# EAGLE design MICROCONTROLLER BRD (EAGLE 9.6.2)
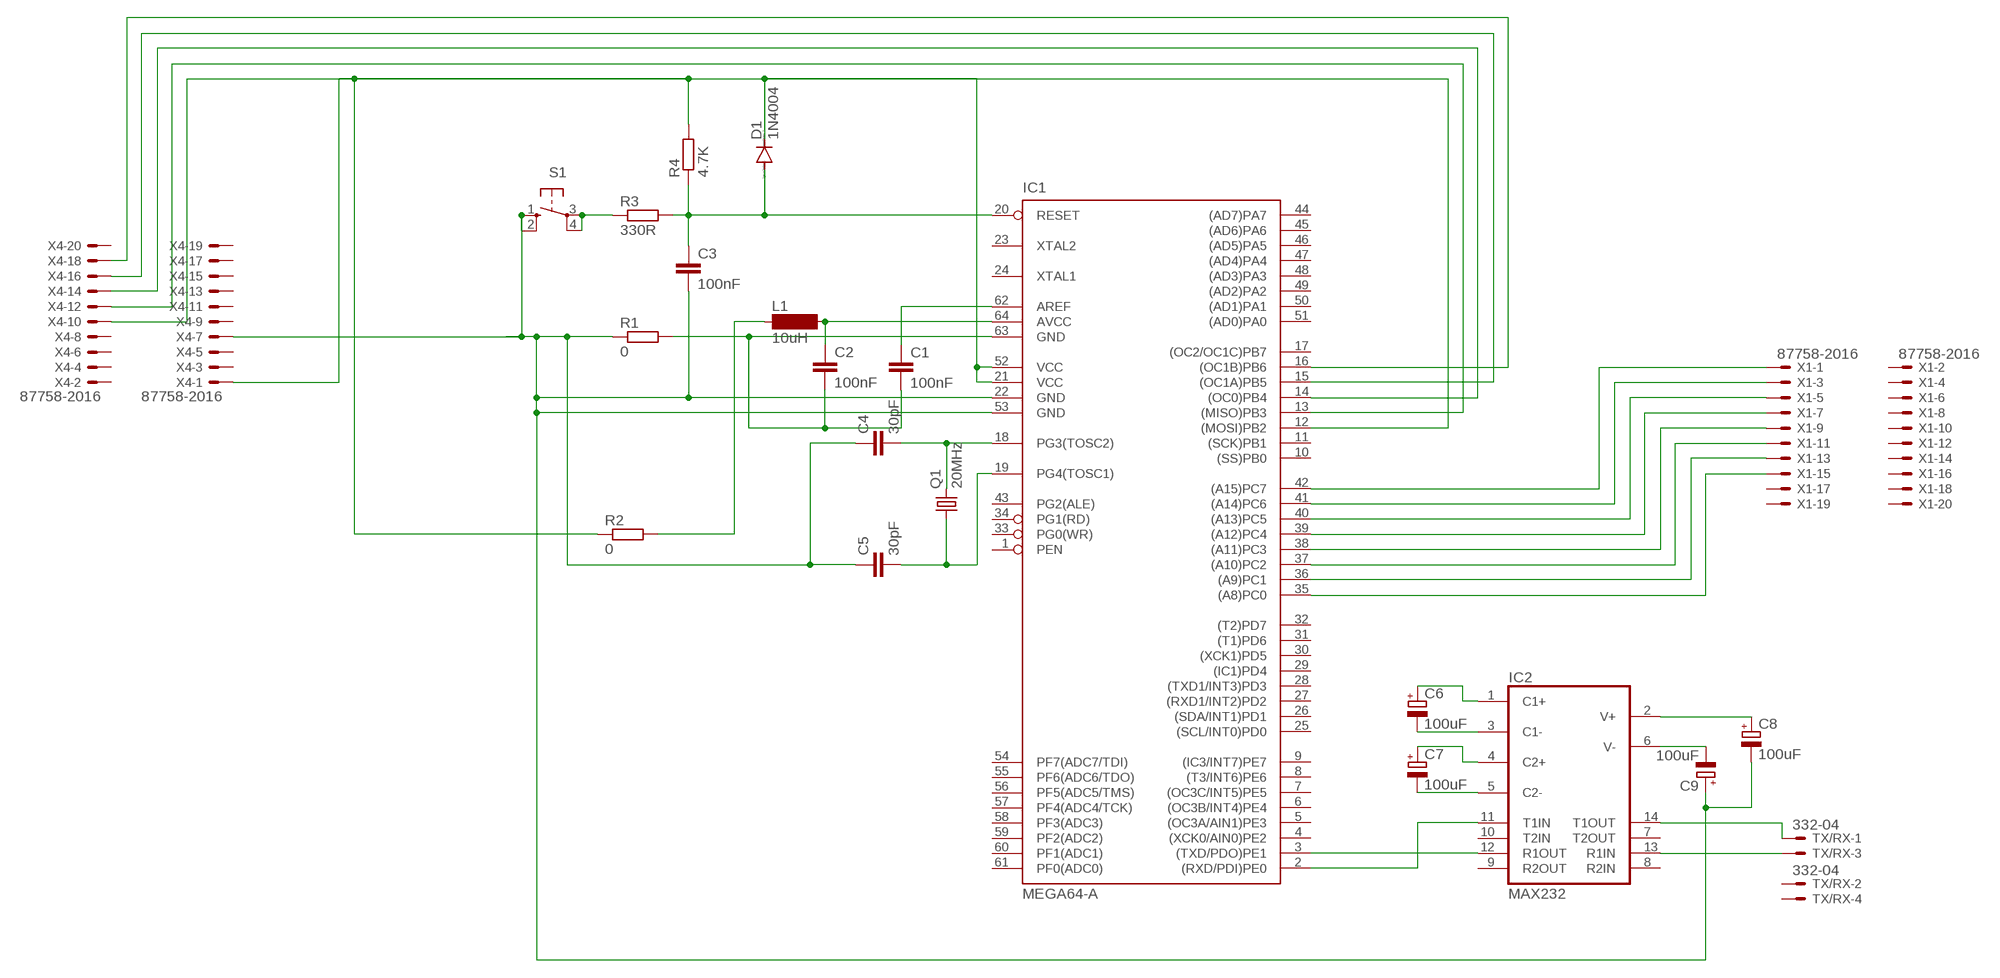
[diagram p0: schematic, sheet 1]

## Parts
C1  100nF  C-EUC0402  [C0402]
C2  100nF  C-EUC0402  [C0402]
C3  100nF  C-EUC0603  [C0603]
C4  30pF  C-EUC0603  [C0603]
C5  30pF  C-EUC0603  [C0603]
C6  100uF  CPOL-EU085CS-1AR  [085CS_1AR]
C7  100uF  CPOL-EU085CS-1AR  [085CS_1AR]
C8  100uF  CPOL-EU085CS-1AR  [085CS_1AR]
C9  100uF  CPOL-EU085CS-1AR  [085CS_1AR]
D1  1N4004  [DO41-10]
IC1  MEGA64-A  [TQFP64]
IC2  MAX232  [DIL16]
L1  10uH  SM-NE45  [SM-NE45]
Q1  20MHz  CRYSTALTC26H  [TC26H]
R1  0  R-EU_R0402  [R0402]
R2  0  R-EU_R0402  [R0402]
R3  330R  R-EU_R0603  [R0603]
R4  4.7K  R-EU_R0603  [R0603]
S1  40-XX  [B3F-40XX]
TX/RX  332-04  [332-04]
X1  87758-2016  [87758-2016]
X4  87758-2016  [87758-2016]

## Nets
N$1: R3.1 S1.3(P) S1.4(P1)
N$2: D1.C IC1.21(VCC) IC1.52(VCC) R2.1 R4.2 X4.1
N$3: C1.1 IC1.62(AREF)
N$4: C1.2 C2.2 IC1.63(GND) R1.2
N$5: C2.1 IC1.64(AVCC) L1.2
N$6: C4.2 IC1.18(PG3(TOSC2)) Q1.2
N$7: L1.1 R2.2
N$8: C3.2 C4.1 C5.1 C8.- C9.+ IC1.22(GND) IC1.53(GND) R1.1 S1.1(S) S1.2(S1) X4.7
N$9: C3.1 D1.A IC1.20(RESET) R3.2 R4.1
N$10: C5.2 IC1.19(PG4(TOSC1)) Q1.1
N$11: C6.+ IC2.1(C1+)
N$12: C6.- IC2.3(C1-)
N$13: C7.+ IC2.4(C2+)
N$14: C7.- IC2.5(C2-)
N$15: C8.+ IC2.2(V+)
N$16: C9.- IC2.6(V-)
N$17: IC1.2((RXD/PDI)PE0) IC2.11(T1IN)
N$18: IC1.3((TXD/PDO)PE1) IC2.12(R1OUT)
N$19: IC2.14(T1OUT) TX/RX.1
N$20: IC2.13(R1IN) TX/RX.3
N$21: IC1.42((A15)PC7) X1.1
N$22: IC1.41((A14)PC6) X1.3
N$23: IC1.40((A13)PC5) X1.5
N$24: IC1.39((A12)PC4) X1.7
N$25: IC1.38((A11)PC3) X1.9
N$26: IC1.37((A10)PC2) X1.11
N$27: IC1.36((A9)PC1) X1.13
N$28: IC1.35((A8)PC0) X1.15
N$30: IC1.16((OC1B)PB6) X4.18
N$31: IC1.15((OC1A)PB5) X4.16
N$32: IC1.14((OC0)PB4) X4.14
N$33: IC1.13((MISO)PB3) X4.12
N$34: IC1.12((MOSI)PB2) X4.10
Unconnected: IC1.1(PEN) IC1.4((XCK0/AIN0)PE2) IC1.5((OC3A/AIN1)PE3) IC1.6((OC3B/INT4)PE4) IC1.7((OC3C/INT5)PE5) IC1.8((T3/INT6)PE6) IC1.9((IC3/INT7)PE7) IC1.10((SS)PB0) IC1.11((SCK)PB1) IC1.17((OC2/OC1C)PB7) IC1.23(XTAL2) IC1.24(XTAL1) IC1.25((SCL/INT0)PD0) IC1.26((SDA/INT1)PD1) IC1.27((RXD1/INT2)PD2) IC1.28((TXD1/INT3)PD3) IC1.29((IC1)PD4) IC1.30((XCK1)PD5) IC1.31((T1)PD6) IC1.32((T2)PD7) IC1.33(PG0(WR)) IC1.34(PG1(RD)) IC1.43(PG2(ALE)) IC1.44((AD7)PA7) IC1.45((AD6)PA6) IC1.46((AD5)PA5) IC1.47((AD4)PA4) IC1.48((AD3)PA3) IC1.49((AD2)PA2) IC1.50((AD1)PA1) IC1.51((AD0)PA0) IC1.54(PF7(ADC7/TDI)) IC1.55(PF6(ADC6/TDO)) IC1.56(PF5(ADC5/TMS)) IC1.57(PF4(ADC4/TCK)) IC1.58(PF3(ADC3)) IC1.59(PF2(ADC2)) IC1.60(PF1(ADC1)) IC1.61(PF0(ADC0)) IC2.7(T2OUT) IC2.8(R2IN) IC2.9(R2OUT) IC2.10(T2IN) TX/RX.2 TX/RX.4 X1.2 X1.4 X1.6 X1.8 X1.10 X1.12 X1.14 X1.16 X1.17 X1.18 X1.19 X1.20 X4.2 X4.3 X4.4 X4.5 X4.6 X4.8 X4.9 X4.11 X4.13 X4.15 X4.17 X4.19 X4.20

## Power pins joined to a net without a drawn wire
GND: IC2.15(GND)
VCC: IC2.16(VCC)

## Library data of the parts
C1-C5 = rcl:C-EU: CAPACITOR, European symbol; SPICEPREFIX: C
C6-C9 = rcl:CPOL-EU: POLARIZED CAPACITOR, European symbol; SPICEPREFIX: C
D1 = diode:1N4004: DIODE general purpose rectifier, 1 A
IC1 = atmel:MEGA64: MICROCONTROLLER 64 Kbytes FLASH 4 Kbytes SRAM 2 Kbytes EEPROM DUAL USART 8-channel 10 bit ADC Source: avr.lbr; MPN: ATMEGA64-16AU; OC_FARNELL: 9171355; OC_NEWARK: 01M6899
IC2 = maxim:MAX232: RS232 TRANSCEIVER; MF: MAXIM; MPN: MAX232ACPE+; OC_FARNELL: 9723773; OC_NEWARK: 68K4544
L1 = inductor-neosid:SM-NE45: INDUCTOR SMD chip inductor; OC_FARNELL: unknown; OC_NEWARK: unknown
Q1 = crystal:CRYSTAL: CRYSTAL; OC_FARNELL: unknown; OC_NEWARK: unknown
R1-R4 = rcl:R-EU_: RESISTOR, European symbol; SPICEPREFIX: R
S1 = switch-omron:40-XX: OMRON SWITCH; MF: OMRON COMPONENTS USA; MPN: B3F-4000; OC_FARNELL: 176434; OC_NEWARK: 36K3105
TX/RX = con-garry:332-04: 4 Pin - 2mm Dual Row Source: www.mpe-connector.de / garry_shortform_2012.pdf
X1 X4 = con-molex:87758-2016: 20 Pin - 2mm Dual Row Single Wafer, Vertical T/H HDR Source: http://www.molex.com/pdm_docs/sd/877580616_sd.pdf; MF: MOLEX; MPN: 87758-2016; OC_FARNELL: 7472374; OC_NEWARK: 25M5677

## Board
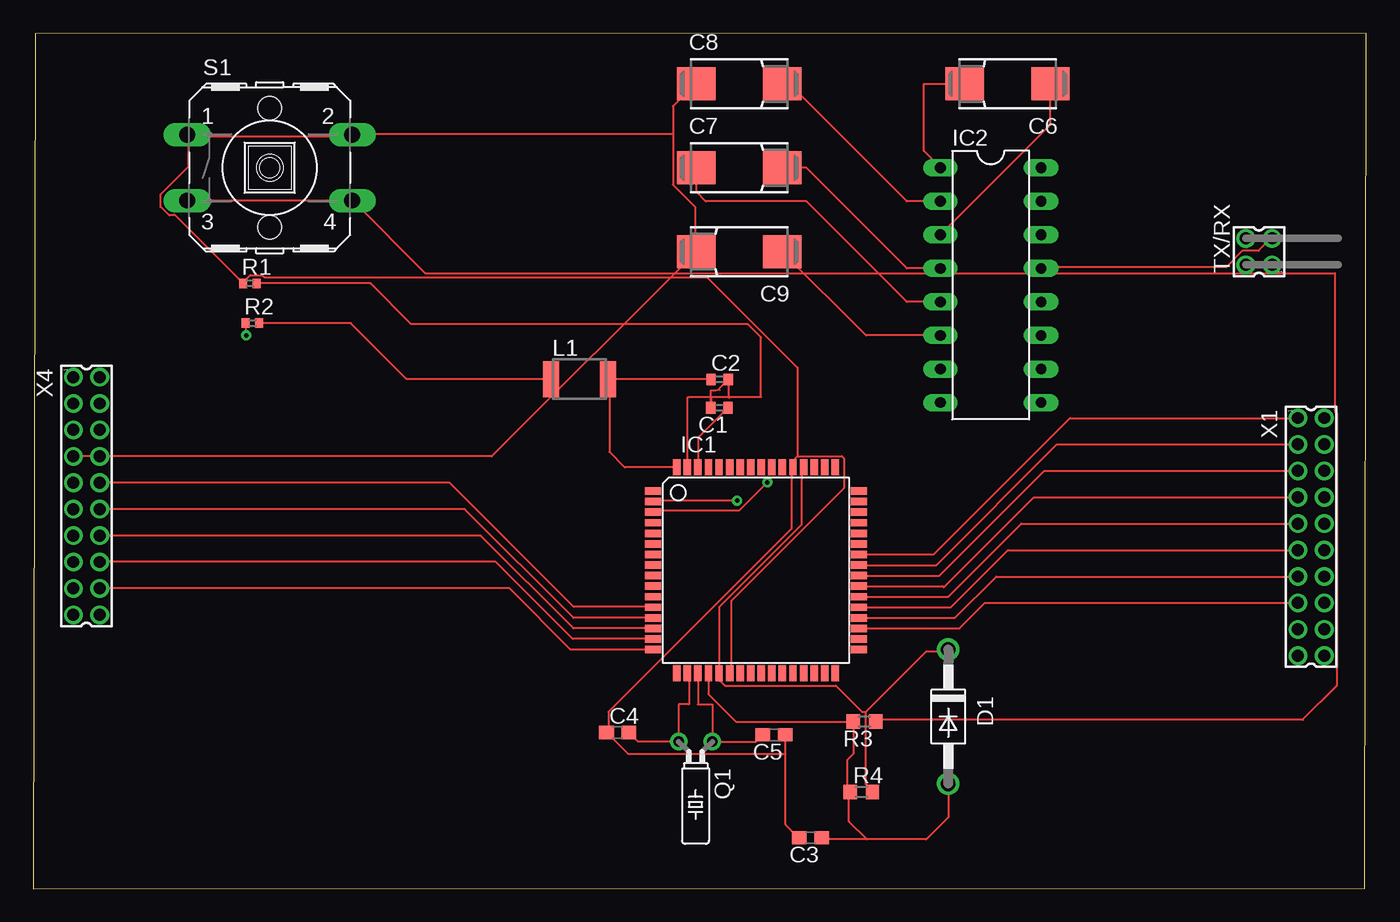
[diagram p1: board, top side]
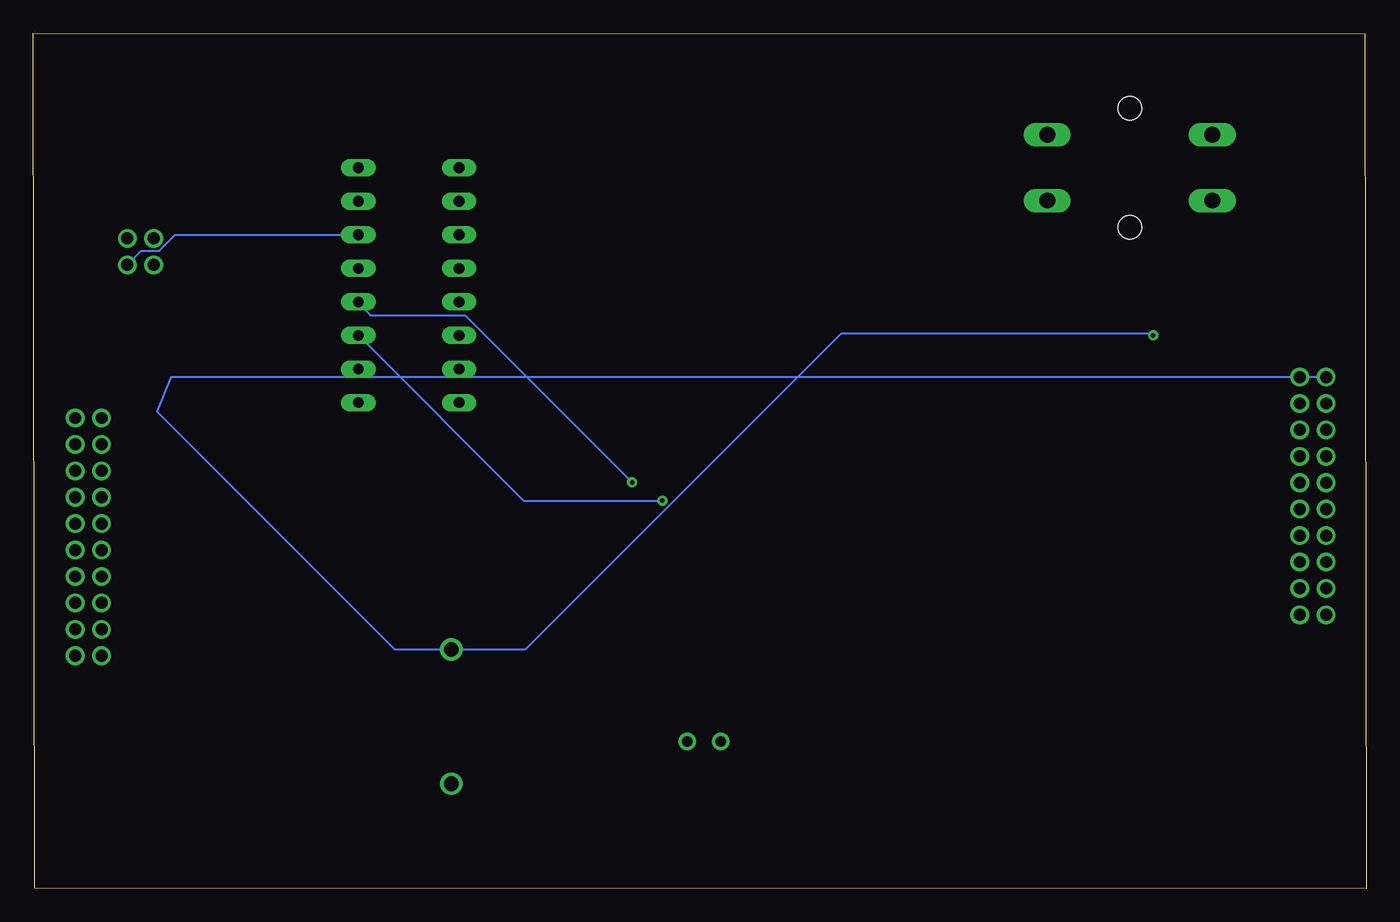
[diagram p2: board, bottom side, seen from below]

Size 101 x 64.8 mm. Coordinates in mm from the lower left corner, seen from the top.
Outline: 0,0 100.85,0.05 101,64.8 0.15,64.75 0,0
Copper layers (1*16): Top 0.035mm / dielectric 1.5mm / Bottom 0.035mm
Design rules "default": minimum track width 6mil, minimum drill 0.35mm, track to track 6mil, track to pad 6mil, pad to pad 6mil, via to via 6mil, smd to smd 6mil, copper to edge 40mil, drill to drill 6mil, minimum pad ring 10mil, minimum via ring 8mil, stop-mask expansion 4mil, vias tented up to drill 0mil, thermal gap 10mil

### Footprints (pad centres in the part's own frame; a part is rotated, then mirrored left to right if it is on the bottom)
C0402 = smd 0.7 x 0.9: 1 -0.65,0; 2 0.65,0
C0603 = smd 1.1 x 1: 1 -0.85,0; 2 0.85,0
085CS_1AR = smd 2.9 x 2.5: + 3.25,0; - -3.25,0
DO41-10 = drill 1.118: A 5.08,0; C -5.08,0
TQFP64 = smd 1.194 x 0.559: 1 -7.8,6; 2 -7.8,5.2; 3 -7.8,4.4; 4 -7.8,3.6; 5 -7.8,2.8; 6 -7.8,2; 7 -7.8,1.2; 8 -7.8,0.4; 9 -7.8,-0.4; 10 -7.8,-1.2; 11 -7.8,-2; 12 -7.8,-2.8; 13 -7.8,-3.6; 14 -7.8,-4.4; 15 -7.8,-5.2; 16 -7.8,-6; 33 7.8,-6; 34 7.8,-5.2; 35 7.8,-4.4; 36 7.8,-3.6; 37 7.8,-2.8; 38 7.8,-2; 39 7.8,-1.2; 40 7.8,-0.4; 41 7.8,0.4; 42 7.8,1.2; 43 7.8,2; 44 7.8,2.8; 45 7.8,3.6; 46 7.8,4.4; 47 7.8,5.2; 48 7.8,6 | smd 0.559 x 1.194: 17 -6,-7.8; 18 -5.2,-7.8; 19 -4.4,-7.8; 20 -3.6,-7.8; 21 -2.8,-7.8; 22 -2,-7.8; 23 -1.2,-7.8; 24 -0.4,-7.8; 25 0.4,-7.8; 26 1.2,-7.8; 27 2,-7.8; 28 2.8,-7.8; 29 3.6,-7.8; 30 4.4,-7.8; 31 5.2,-7.8; 32 6,-7.8; 49 6,7.8; 50 5.2,7.8; 51 4.4,7.8; 52 3.6,7.8; 53 2.8,7.8; 54 2,7.8; 55 1.2,7.8; 56 0.4,7.8; 57 -0.4,7.8; 58 -1.2,7.8; 59 -2,7.8; 60 -2.8,7.8; 61 -3.6,7.8; 62 -4.4,7.8; 63 -5.2,7.8; 64 -6,7.8
DIL16 = drill 0.813 long: 1 -8.89,-3.81; 2 -6.35,-3.81; 3 -3.81,-3.81; 4 -1.27,-3.81; 5 1.27,-3.81; 6 3.81,-3.81; 7 6.35,-3.81; 8 8.89,-3.81; 9 8.89,3.81; 10 6.35,3.81; 11 3.81,3.81; 12 1.27,3.81; 13 -1.27,3.81; 14 -3.81,3.81; 15 -6.35,3.81; 16 -8.89,3.81
SM-NE45 = smd 1.2 x 2.7: 1 -2.15,0; 2 2.15,0
TC26H = drill 0.813: 1 -1.27,0; 2 1.27,0
R0402 = smd 0.6 x 0.7: 1 -0.5,0; 2 0.5,0
R0603 = smd 1 x 1.1: 1 -0.85,0; 2 0.85,0
B3F-40XX = drill 1.194 long: 1 -6.248,2.489; 2 6.248,2.489; 3 -6.248,-2.489; 4 6.248,-2.489 | hole 1.803: 0,-4.496; 0,4.496
332-04 = drill 0.9 pad 1.27: 1 -1,-1; 2 -1,1; 3 1,-1; 4 1,1
87758-2016 = drill 0.9 pad 1.27: 1 -9,-1; 2 -9,1; 3 -7,-1; 4 -7,1; 5 -5,-1; 6 -5,1; 7 -3,-1; 8 -3,1; 9 -1,-1; 10 -1,1; 11 1,-1; 12 1,1; 13 3,-1; 14 3,1; 15 5,-1; 16 5,1; 17 7,-1; 18 7,1; 19 9,-1; 20 9,1

### Placement (x,y rotation side)
C1  51.99,36.43 180 top
C2  52,38.57 0 top
C3  58.89,3.88 180 top
C4  44.29,11.84 0 top
C5  56.13,11.66 180 top
C6  73.81,60.95 180 top
C7  53.49,54.6 0 top
C8  53.49,60.95 0 top
C9  53.49,48.25 180 top
D1  69.32,13.04 270 top
IC1  54.76,24.12 0 top
IC2  72.54,45.71 270 top
L1  41.4,38.59 0 top
Q1  50.18,11.15 180 top
R1  16.43,45.84 0 top
R2  16.62,42.84 0 top
R3  62.98,12.66 180 top
R4  62.74,7.34 0 top
S1  17.93,54.6 0 top
TX/RX  92.86,48.25 90 top
X1  96.8,26.65 270 top
X4  4.05,29.75 270 top

### Tracks (layer width: path | path; a pad name or v marks a point on that pad's centre or on a via)
N$1
  Top 0.152: 96.18,12.79 96.15,12.79 | 96.15,12.79 63.85,12.79 R3.1 | S1.3 S1.4 24.23,52.11 29.72,46.62 98.6,46.62 98.6,36.17 98.73,36.04 98.73,15.37 96.15,12.79
N$2  (via drill 0.35)
  Top 0.152: 16.07,42.79 R2.1 16.15,42.81 v16.15,41.9 | 63.09,13.4 67.66,17.97 69.19,17.97 D1.C | 63.09,13.4 63.09,7.91 63.55,7.46 R4.2 | IC1.52 58.21,31.84 58.21,27.57 51.97,21.33 51.97,16.45 IC1.21 51.97,16.3 51.97,15.84 52.42,15.38 60.8,15.38 62.79,13.4 63.09,13.4
  Bottom 0.152: v16.15,41.9 16.15,42.06 39.76,42.06 63.7,18.13 69.19,18.13 D1.C 69.34,18.13 73.61,18.13 91.59,36.11 90.53,38.75 X4.1
N$3
  Top 0.152: C1.1 50.36,34.15 IC1.62
N$4
  Top 0.152: 17.01,45.92 R1.2 25.56,45.84 28.65,42.75 54.15,42.75 55.15,41.75 55.15,37.25 52.73,37.25 | IC1.63 49.56,37.16 49.65,37.25 51.36,37.25 | 51.36,37.25 52.73,37.25 | 51.36,37.25 51.36,36.57 | 52.73,37.25 52.73,38.55 C2.2 52,37.92 52,37.78 51.7,37.72 51.34,37.72 C1.2 | 52.73,37.18 52.73,37.25
N$5
  Top 0.152: IC1.64 44.82,31.92 43.65,33.09 43.65,38.57 C2.1 43.57,38.57 L1.2
N$6
  Top 0.152: IC1.18 49.68,16.2 49.68,13.96 48.91,13.96 Q1.2 45.83,11.15 C4.2
N$7
  Top 0.152: L1.1 28.31,38.59 24.06,42.84 R2.2
N$8
  Top 0.152: R1.1 15.84,45.75 | 56.99,10.2 56.99,4.87 57.91,3.95 C3.2 | 56.99,10.2 56.99,11.57 C5.1 | 56.99,10.2 45.11,10.2 43.58,11.73 C4.1 43.58,11.88 43.58,13.4 57.45,27.27 57.45,31.84 IC1.53 57.6,31.99 57.6,32.45 57.91,32.76 | 57.91,32.76 61.26,32.76 61.41,32.6 61.41,30.32 52.88,21.78 52.88,16.45 IC1.22 | 11.8,56.99 11.73,56.99 S1.1 | 11.8,56.99 24.08,56.99 S1.2 24.23,57.14 48.46,57.14 | 48.46,57.14 48.46,59.27 50.14,60.95 C8.- | 48.46,57.14 48.46,53.33 50.14,51.65 50.14,48.3 C9.+ 34.74,32.75 X4.7 | 57.91,32.76 57.91,39.46 51.05,46.32 17.52,46.32 17.37,46.47 16.46,46.47 15.85,45.86 R1.1 | 11.8,56.99 11.8,54.71 9.66,52.58 9.66,51.64 10.32,50.99 10.78,50.99 R1.1
N$9
  Top 0.152: IC1.20 51.16,14.76 51.15,14.75 53.24,12.66 R3.2 62.13,10.23 61.65,9.75 61.65,7.58 61.81,7.41 | 61.81,7.41 R4.1 | D1.A 69.32,5.42 67.65,3.75 63.15,3.75 | 61.81,7.41 61.81,5.09 63.15,3.75 | 63.15,3.75 59.87,3.75 C3.1
N$10
  Top 0.152: IC1.19 50.36,13.96 51.45,13.96 Q1.1 54.77,11.15 C5.2
N$11
  Top 0.152: IC2.1 67.46,55.87 67.46,60.95 C6.+ 71.27,60.95
N$12
  Top 0.152: IC2.3 77.06,57.85 C6.-
N$13
  Top 0.152: IC2.4 66.19,46.98 58.57,54.6 C7.+ 56.03,54.6
N$14
  Top 0.152: IC2.5 66.19,44.44 58.57,52.06 50.95,52.06 50.24,52.77 C7.-
N$15
  Top 0.152: IC2.2 66.19,52.06 57.3,60.95 C8.+
N$16
  Top 0.152: IC2.6 63.09,41.9 C9.-
N$17  (via drill 0.35)
  Top 0.152: v53.34,29.4 47.09,29.4 IC1.2
  Bottom 0.152: v53.34,29.4 63.85,29.4 IC2.11
N$18  (via drill 0.35)
  Top 0.152: v55.62,30.77 53.49,28.64 47.09,28.64 IC1.3
  Bottom 0.152: v55.62,30.77 68.27,43.42 75.44,43.42 76.35,44.34 IC2.12
N$19
  Bottom 0.152: IC2.14 90.22,49.52 91.44,48.3 92.81,48.3 TX/RX.1
N$20
  Top 0.152: IC2.13 76.35,47.08 90.37,47.08 91.59,48.3 92.81,48.3 93.72,49.22 TX/RX.3
N$21
  Top 0.152: IC1.42 68.22,25.32 78.55,35.65 X1.1
N$22
  Top 0.152: IC1.41 68.42,24.52 77.55,33.65 X1.3
N$23
  Top 0.152: IC1.40 68.67,23.72 76.6,31.65 X1.5
N$24
  Top 0.152: IC1.39 68.88,22.92 68.95,22.85 69,22.85 75.8,29.65 X1.7
N$25
  Top 0.152: IC1.38 69.32,22.12 74.85,27.65 X1.9
N$26
  Top 0.152: IC1.37 69.52,21.32 73.85,25.65 X1.11
N$27
  Top 0.152: IC1.36 69.82,20.52 72.95,23.65 X1.13
N$28
  Top 0.152: IC1.35 70.17,19.72 72.1,21.65 X1.15
N$30
  Top 0.152: IC1.16 40.73,18.12 36.1,22.75 X4.18
N$31
  Top 0.152: IC1.15 40.88,18.92 35.05,24.75 X4.16
N$32
  Top 0.152: IC1.14 40.93,19.72 33.9,26.75 X4.14
N$33
  Top 0.152: IC1.13 40.93,20.52 32.7,28.75 X4.12
N$34
  Top 0.152: IC1.12 46.93,21.35 40.95,21.35 31.55,30.75 X4.10